# Altium schematic sheet Bank 13_Bank 15_Bank 16.SchDoc
size A3; SheetNumber: 11; SheetTotal: 22
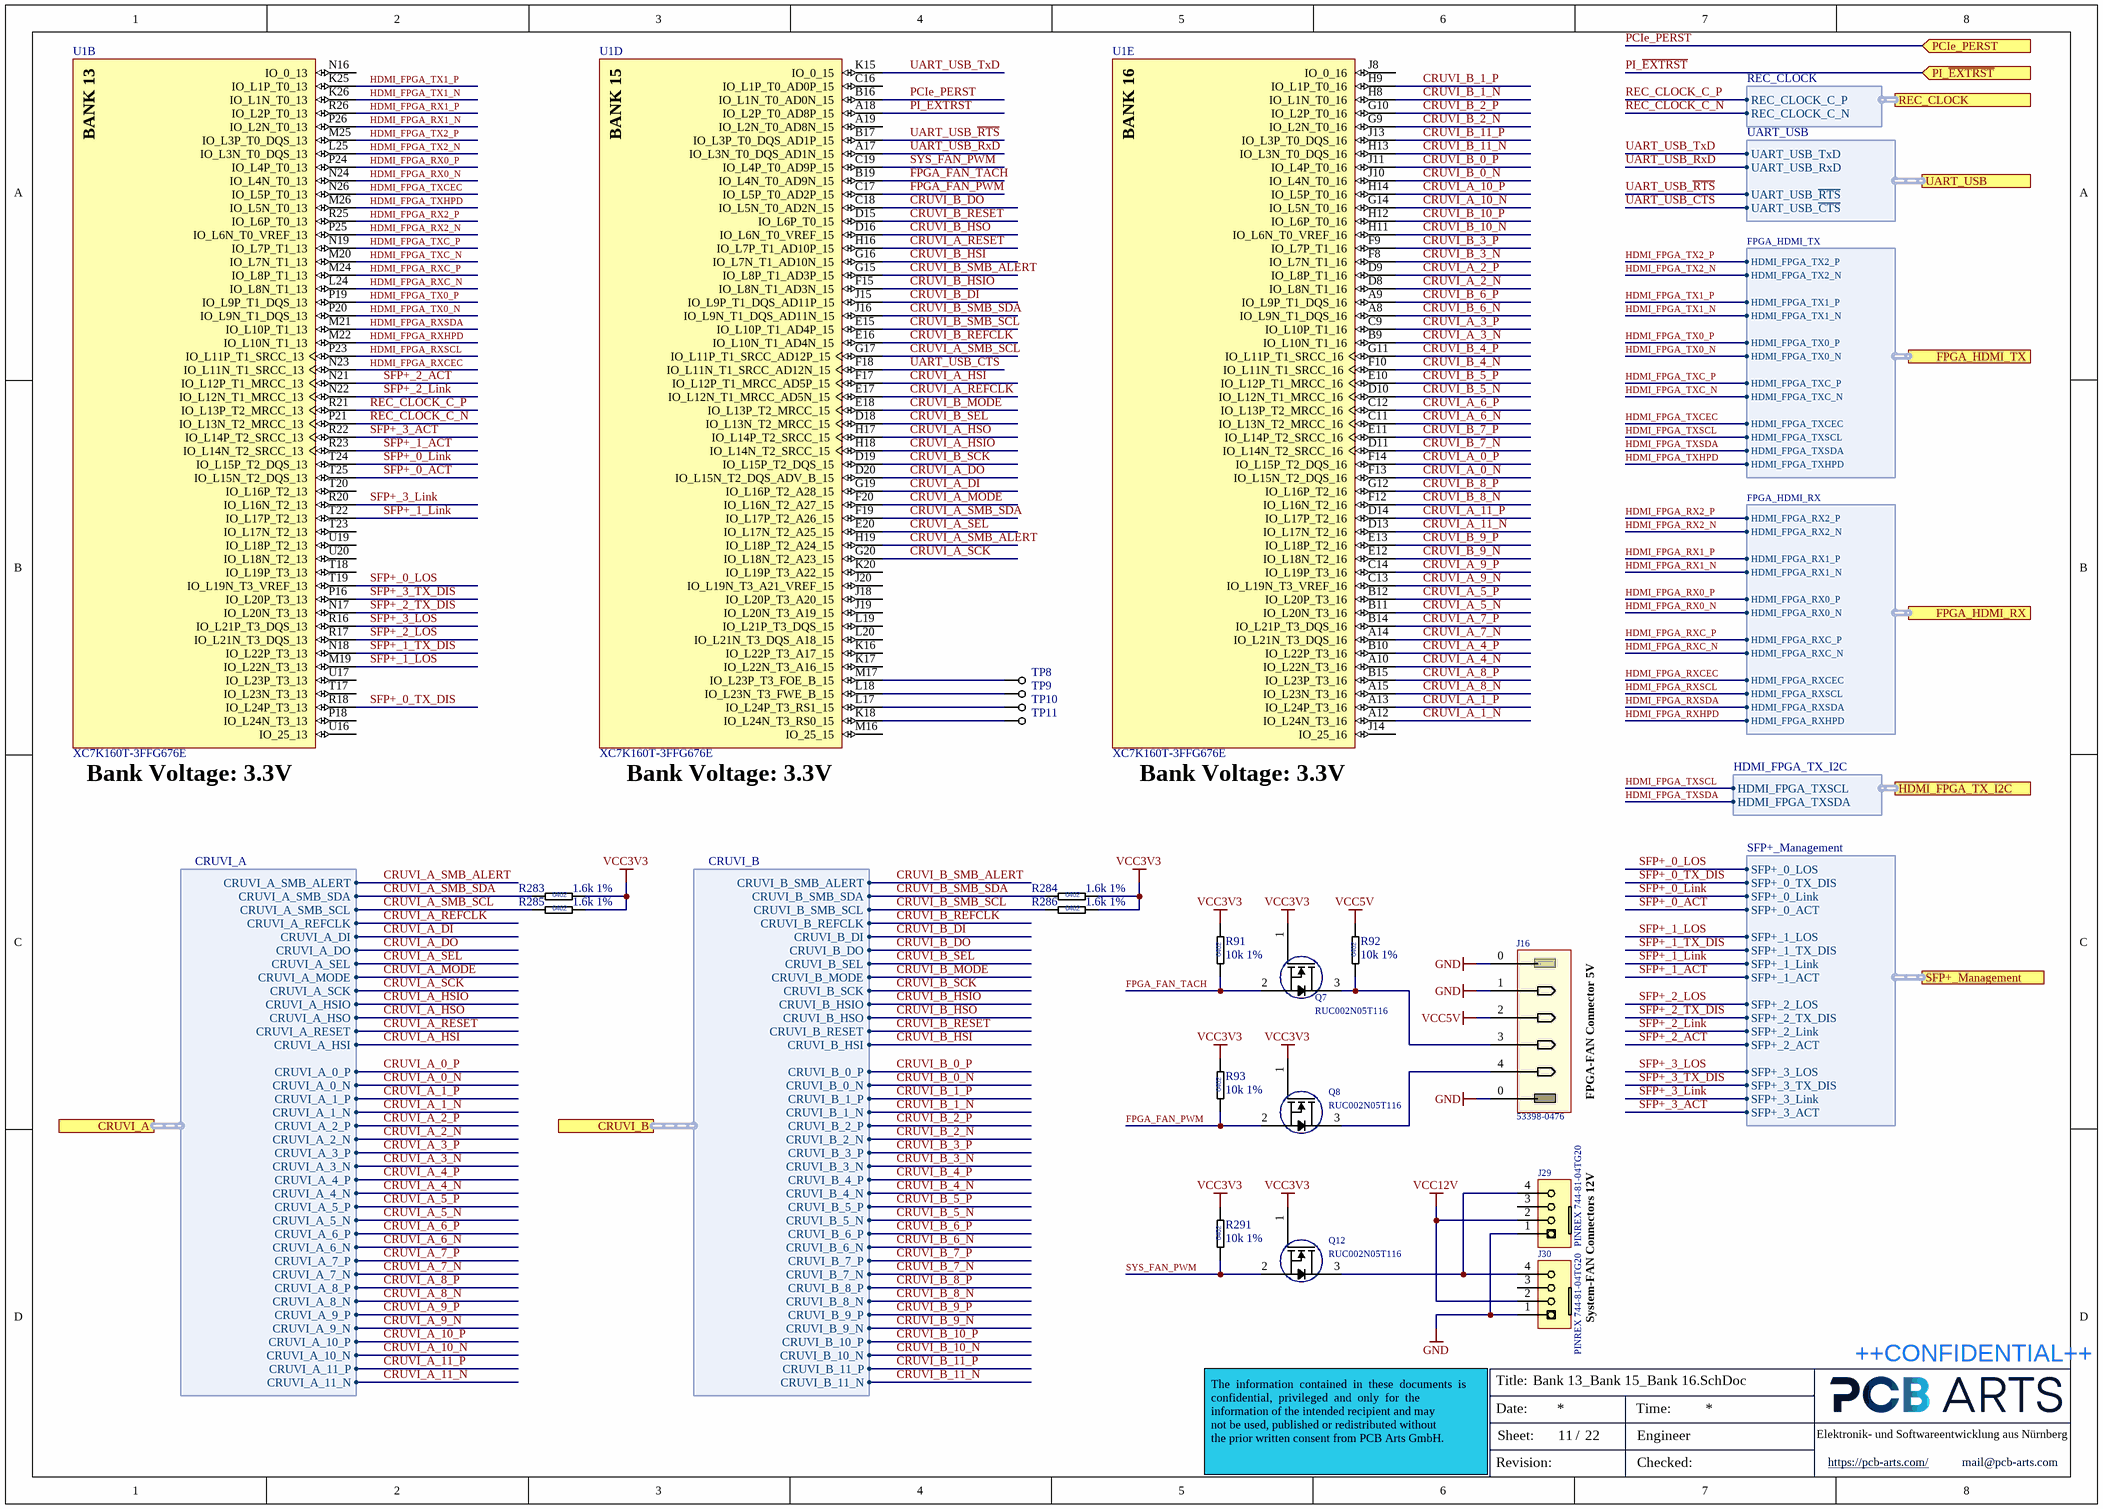
[diagram p0: Bank 13_Bank 15_Bank 16.SchDoc]

## Parts
J16  53398-0476  [Molex 53398-0476]
J29  PINREX 744-81-04TG20  [PINREX 744-81-04TG20]
J30  PINREX 744-81-04TG20  [PINREX 744-81-04TG20]
Q7  RUC002N05T116  [SOT95P251X112-3N]
Q8  RUC002N05T116  [SOT95P251X112-3N]
Q12  RUC002N05T116  [SOT95P251X112-3N]
R91  10k 1%  [RES_0402_L]
R92  10k 1%  [RES_0402_L]
R93  10k 1%  [RES_0402_L]
R283  1.6k 1%  [RES_0402_L]
R284  1.6k 1%  [RES_0402_L]
R285  1.6k 1%  [RES_0402_L]
R286  1.6k 1%  [RES_0402_L]
R291  10k 1%  [RES_0402_L]
TP8  Testpoint  [Testpoint 0.8mm]  (value not drawn)  (no BOM)
TP9  Testpoint  [Testpoint 0.8mm]  (value not drawn)  (no BOM)
TP10  Testpoint  [Testpoint 0.8mm]  (value not drawn)  (no BOM)
TP11  Testpoint  [Testpoint 0.8mm]  (value not drawn)  (no BOM)
U1  XC7K160T-3FFG676E  [BGA100P2700X2700X317-676N]  (parts B,D,E of 14)

## Ports
CRUVI_A (harness CRUVI_A, see Top-Level-Sheet[5B], Spare Pins[1B]), CRUVI_B (harness CRUVI_B, see Top-Level-Sheet[5B], Spare Pins[1C]), FPGA_HDMI_RX (harness FPGA_HDMI_RX, see Top-Level-Sheet[5B], FPGA_HDMI_IN_OUT[1D]), FPGA_HDMI_TX (harness FPGA_HDMI_TX, see Top-Level-Sheet[5B], FPGA_HDMI_IN_OUT[1A]), HDMI_FPGA_TX_I2C (harness HDMI_FPGA_TX_I2C, see Top-Level-Sheet[5B], I2C Multiplexer[7A]), PCIe_PERST (in, see Top-Level-Sheet[5B], Raspberry Pi CM4[8B]), PI_~{EXTRST} (in, see Top-Level-Sheet[5C], Raspberry Pi CM4[8B]), REC_CLOCK (harness REC_CLOCK, see Top-Level-Sheet[5B], System Clocks[1A]), SFP+_Management (harness SFP+_Management, see Top-Level-Sheet[5B], SFP+_Connectors[8C]), UART_USB (harness UART_USB, see Top-Level-Sheet[5B], USB-UART-interface[8A])

## Harnesses
UART_USB: UART_USB_TxD, UART_USB_RxD, UART_USB_~{RTS}, UART_USB_~{CTS}
FPGA_HDMI_TX: HDMI_FPGA_TX2_P, HDMI_FPGA_TX2_N, HDMI_FPGA_TX1_P, HDMI_FPGA_TX1_N, HDMI_FPGA_TX0_P, HDMI_FPGA_TX0_N, HDMI_FPGA_TXC_P, HDMI_FPGA_TXC_N, HDMI_FPGA_TXCEC, HDMI_FPGA_TXSCL, HDMI_FPGA_TXSDA, HDMI_FPGA_TXHPD
FPGA_HDMI_RX: HDMI_FPGA_RX2_P, HDMI_FPGA_RX2_N, HDMI_FPGA_RX1_P, HDMI_FPGA_RX1_N, HDMI_FPGA_RX0_P, HDMI_FPGA_RX0_N, HDMI_FPGA_RXC_P, HDMI_FPGA_RXC_N, HDMI_FPGA_RXCEC, HDMI_FPGA_RXSCL, HDMI_FPGA_RXSDA, HDMI_FPGA_RXHPD
HDMI_FPGA_TX_I2C: HDMI_FPGA_TXSCL, HDMI_FPGA_TXSDA
REC_CLOCK: REC_CLOCK_C_P, REC_CLOCK_C_N
SFP+_Management: SFP+_0_LOS, SFP+_0_TX_DIS, SFP+_0_Link, SFP+_0_ACT, SFP+_1_LOS, SFP+_1_TX_DIS, SFP+_1_Link, SFP+_1_ACT, SFP+_2_LOS, SFP+_2_TX_DIS, SFP+_2_Link, SFP+_2_ACT, SFP+_3_LOS, SFP+_3_TX_DIS, SFP+_3_Link, SFP+_3_ACT
CRUVI_A: CRUVI_A_SMB_ALERT, CRUVI_A_SMB_SDA, CRUVI_A_SMB_SCL, CRUVI_A_REFCLK, CRUVI_A_DI, CRUVI_A_DO, CRUVI_A_SEL, CRUVI_A_MODE, CRUVI_A_SCK, CRUVI_A_HSIO, CRUVI_A_HSO, CRUVI_A_RESET, CRUVI_A_HSI, CRUVI_A_0_P, CRUVI_A_0_N, CRUVI_A_1_P, CRUVI_A_1_N, CRUVI_A_2_P, CRUVI_A_2_N, CRUVI_A_3_P, CRUVI_A_3_N, CRUVI_A_4_P, CRUVI_A_4_N, CRUVI_A_5_P, CRUVI_A_5_N, CRUVI_A_6_P, CRUVI_A_6_N, CRUVI_A_7_P, CRUVI_A_7_N, CRUVI_A_8_P, CRUVI_A_8_N, CRUVI_A_9_P, CRUVI_A_9_N, CRUVI_A_10_P, CRUVI_A_10_N, CRUVI_A_11_P, CRUVI_A_11_N
CRUVI_B: CRUVI_B_SMB_ALERT, CRUVI_B_SMB_SDA, CRUVI_B_SMB_SCL, CRUVI_B_REFCLK, CRUVI_B_DI, CRUVI_B_DO, CRUVI_B_SEL, CRUVI_B_MODE, CRUVI_B_SCK, CRUVI_B_HSIO, CRUVI_B_HSO, CRUVI_B_RESET, CRUVI_B_HSI, CRUVI_B_0_P, CRUVI_B_0_N, CRUVI_B_1_P, CRUVI_B_1_N, CRUVI_B_2_P, CRUVI_B_2_N, CRUVI_B_3_P, CRUVI_B_3_N, CRUVI_B_4_P, CRUVI_B_4_N, CRUVI_B_5_P, CRUVI_B_5_N, CRUVI_B_6_P, CRUVI_B_6_N, CRUVI_B_7_P, CRUVI_B_7_N, CRUVI_B_8_P, CRUVI_B_8_N, CRUVI_B_9_P, CRUVI_B_9_N, CRUVI_B_10_P, CRUVI_B_10_N, CRUVI_B_11_P, CRUVI_B_11_N

## Nets
GND: J16.0 J16.1 J29.1 J30.1
VCC3V3: Q7.1(G) Q8.1(G) Q12.1(G) R91.2 R93.2 R283.2 R284.2 R285.2 R286.2 R291.2
VCC5V: J16.2 R92.2
VCC12V: J29.2 J30.2
CRUVI_A_0_N: U1.F13(IO_L15N_T2_DQS_16) ; port CRUVI_A.CRUVI_A_0_N
CRUVI_A_0_P: U1.F14(IO_L15P_T2_DQS_16) ; port CRUVI_A.CRUVI_A_0_P
CRUVI_A_1_N: U1.A12(IO_L24N_T3_16) ; port CRUVI_A.CRUVI_A_1_N
CRUVI_A_1_P: U1.A13(IO_L24P_T3_16) ; port CRUVI_A.CRUVI_A_1_P
CRUVI_A_2_N: U1.D8(IO_L8N_T1_16) ; port CRUVI_A.CRUVI_A_2_N
CRUVI_A_2_P: U1.D9(IO_L8P_T1_16) ; port CRUVI_A.CRUVI_A_2_P
CRUVI_A_3_N: U1.B9(IO_L10N_T1_16) ; port CRUVI_A.CRUVI_A_3_N
CRUVI_A_3_P: U1.C9(IO_L10P_T1_16) ; port CRUVI_A.CRUVI_A_3_P
CRUVI_A_4_N: U1.A10(IO_L22N_T3_16) ; port CRUVI_A.CRUVI_A_4_N
CRUVI_A_4_P: U1.B10(IO_L22P_T3_16) ; port CRUVI_A.CRUVI_A_4_P
CRUVI_A_5_N: U1.B11(IO_L20N_T3_16) ; port CRUVI_A.CRUVI_A_5_N
CRUVI_A_5_P: U1.B12(IO_L20P_T3_16) ; port CRUVI_A.CRUVI_A_5_P
CRUVI_A_6_N: U1.C11(IO_L13N_T2_MRCC_16) ; port CRUVI_A.CRUVI_A_6_N
CRUVI_A_6_P: U1.C12(IO_L13P_T2_MRCC_16) ; port CRUVI_A.CRUVI_A_6_P
CRUVI_A_7_N: U1.A14(IO_L21N_T3_DQS_16) ; port CRUVI_A.CRUVI_A_7_N
CRUVI_A_7_P: U1.B14(IO_L21P_T3_DQS_16) ; port CRUVI_A.CRUVI_A_7_P
CRUVI_A_8_N: U1.A15(IO_L23N_T3_16) ; port CRUVI_A.CRUVI_A_8_N
CRUVI_A_8_P: U1.B15(IO_L23P_T3_16) ; port CRUVI_A.CRUVI_A_8_P
CRUVI_A_9_N: U1.C13(IO_L19N_T3_VREF_16) ; port CRUVI_A.CRUVI_A_9_N
CRUVI_A_9_P: U1.C14(IO_L19P_T3_16) ; port CRUVI_A.CRUVI_A_9_P
CRUVI_A_10_N: U1.G14(IO_L5N_T0_16) ; port CRUVI_A.CRUVI_A_10_N
CRUVI_A_10_P: U1.H14(IO_L5P_T0_16) ; port CRUVI_A.CRUVI_A_10_P
CRUVI_A_11_N: U1.D13(IO_L17N_T2_16) ; port CRUVI_A.CRUVI_A_11_N
CRUVI_A_11_P: U1.D14(IO_L17P_T2_16) ; port CRUVI_A.CRUVI_A_11_P
CRUVI_A_DI: U1.G19(IO_L16P_T2_A28_15) ; port CRUVI_A.CRUVI_A_DI
CRUVI_A_DO: U1.D20(IO_L15N_T2_DQS_ADV_B_15) ; port CRUVI_A.CRUVI_A_DO
CRUVI_A_HSI: U1.F17(IO_L12P_T1_MRCC_AD5P_15) ; port CRUVI_A.CRUVI_A_HSI
CRUVI_A_HSIO: U1.H18(IO_L14N_T2_SRCC_15) ; port CRUVI_A.CRUVI_A_HSIO
CRUVI_A_HSO: U1.H17(IO_L14P_T2_SRCC_15) ; port CRUVI_A.CRUVI_A_HSO
CRUVI_A_MODE: U1.F20(IO_L16N_T2_A27_15) ; port CRUVI_A.CRUVI_A_MODE
CRUVI_A_REFCLK: U1.E17(IO_L12N_T1_MRCC_AD5N_15) ; port CRUVI_A.CRUVI_A_REFCLK
CRUVI_A_RESET: U1.H16(IO_L7P_T1_AD10P_15) ; port CRUVI_A.CRUVI_A_RESET
CRUVI_A_SCK: U1.G20(IO_L18N_T2_A23_15) ; port CRUVI_A.CRUVI_A_SCK
CRUVI_A_SEL: U1.E20(IO_L17N_T2_A25_15) ; port CRUVI_A.CRUVI_A_SEL
CRUVI_A_SMB_ALERT: U1.H19(IO_L18P_T2_A24_15) ; port CRUVI_A.CRUVI_A_SMB_ALERT
CRUVI_A_SMB_SCL: R285.1 U1.G17(IO_L11P_T1_SRCC_AD12P_15) ; port CRUVI_A.CRUVI_A_SMB_SCL
CRUVI_A_SMB_SDA: R283.1 U1.F19(IO_L17P_T2_A26_15) ; port CRUVI_A.CRUVI_A_SMB_SDA
CRUVI_B_0_N: U1.J10(IO_L4N_T0_16) ; port CRUVI_B.CRUVI_B_0_N
CRUVI_B_0_P: U1.J11(IO_L4P_T0_16) ; port CRUVI_B.CRUVI_B_0_P
CRUVI_B_1_N: U1.H8(IO_L1N_T0_16) ; port CRUVI_B.CRUVI_B_1_N
CRUVI_B_1_P: U1.H9(IO_L1P_T0_16) ; port CRUVI_B.CRUVI_B_1_P
CRUVI_B_2_N: U1.G9(IO_L2N_T0_16) ; port CRUVI_B.CRUVI_B_2_N
CRUVI_B_2_P: U1.G10(IO_L2P_T0_16) ; port CRUVI_B.CRUVI_B_2_P
CRUVI_B_3_N: U1.F8(IO_L7N_T1_16) ; port CRUVI_B.CRUVI_B_3_N
CRUVI_B_3_P: U1.F9(IO_L7P_T1_16) ; port CRUVI_B.CRUVI_B_3_P
CRUVI_B_4_N: U1.F10(IO_L11N_T1_SRCC_16) ; port CRUVI_B.CRUVI_B_4_N
CRUVI_B_4_P: U1.G11(IO_L11P_T1_SRCC_16) ; port CRUVI_B.CRUVI_B_4_P
CRUVI_B_5_N: U1.D10(IO_L12N_T1_MRCC_16) ; port CRUVI_B.CRUVI_B_5_N
CRUVI_B_5_P: U1.E10(IO_L12P_T1_MRCC_16) ; port CRUVI_B.CRUVI_B_5_P
CRUVI_B_6_N: U1.A8(IO_L9N_T1_DQS_16) ; port CRUVI_B.CRUVI_B_6_N
CRUVI_B_6_P: U1.A9(IO_L9P_T1_DQS_16) ; port CRUVI_B.CRUVI_B_6_P
CRUVI_B_7_N: U1.D11(IO_L14N_T2_SRCC_16) ; port CRUVI_B.CRUVI_B_7_N
CRUVI_B_7_P: U1.E11(IO_L14P_T2_SRCC_16) ; port CRUVI_B.CRUVI_B_7_P
CRUVI_B_8_N: U1.F12(IO_L16N_T2_16) ; port CRUVI_B.CRUVI_B_8_N
CRUVI_B_8_P: U1.G12(IO_L16P_T2_16) ; port CRUVI_B.CRUVI_B_8_P
CRUVI_B_9_N: U1.E12(IO_L18N_T2_16) ; port CRUVI_B.CRUVI_B_9_N
CRUVI_B_9_P: U1.E13(IO_L18P_T2_16) ; port CRUVI_B.CRUVI_B_9_P
CRUVI_B_10_N: U1.H11(IO_L6N_T0_VREF_16) ; port CRUVI_B.CRUVI_B_10_N
CRUVI_B_10_P: U1.H12(IO_L6P_T0_16) ; port CRUVI_B.CRUVI_B_10_P
CRUVI_B_11_N: U1.H13(IO_L3N_T0_DQS_16) ; port CRUVI_B.CRUVI_B_11_N
CRUVI_B_11_P: U1.J13(IO_L3P_T0_DQS_16) ; port CRUVI_B.CRUVI_B_11_P
CRUVI_B_DI: U1.J15(IO_L9P_T1_DQS_AD11P_15) ; port CRUVI_B.CRUVI_B_DI
CRUVI_B_DO: U1.C18(IO_L5N_T0_AD2N_15) ; port CRUVI_B.CRUVI_B_DO
CRUVI_B_HSI: U1.G16(IO_L7N_T1_AD10N_15) ; port CRUVI_B.CRUVI_B_HSI
CRUVI_B_HSIO: U1.F15(IO_L8N_T1_AD3N_15) ; port CRUVI_B.CRUVI_B_HSIO
CRUVI_B_HSO: U1.D16(IO_L6N_T0_VREF_15) ; port CRUVI_B.CRUVI_B_HSO
CRUVI_B_MODE: U1.E18(IO_L13P_T2_MRCC_15) ; port CRUVI_B.CRUVI_B_MODE
CRUVI_B_REFCLK: U1.E16(IO_L10N_T1_AD4N_15) ; port CRUVI_B.CRUVI_B_REFCLK
CRUVI_B_RESET: U1.D15(IO_L6P_T0_15) ; port CRUVI_B.CRUVI_B_RESET
CRUVI_B_SCK: U1.D19(IO_L15P_T2_DQS_15) ; port CRUVI_B.CRUVI_B_SCK
CRUVI_B_SEL: U1.D18(IO_L13N_T2_MRCC_15) ; port CRUVI_B.CRUVI_B_SEL
CRUVI_B_SMB_ALERT: U1.G15(IO_L8P_T1_AD3P_15) ; port CRUVI_B.CRUVI_B_SMB_ALERT
CRUVI_B_SMB_SCL: R286.1 U1.E15(IO_L10P_T1_AD4P_15) ; port CRUVI_B.CRUVI_B_SMB_SCL
CRUVI_B_SMB_SDA: R284.1 U1.J16(IO_L9N_T1_DQS_AD11N_15) ; port CRUVI_B.CRUVI_B_SMB_SDA
FPGA_FAN_PWM: Q8.2(D) R93.1 U1.C17(IO_L5P_T0_AD2P_15)
FPGA_FAN_TACH: Q7.2(D) R91.1 U1.B19(IO_L4N_T0_AD9N_15)
HDMI_FPGA_RX0_N: U1.N24(IO_L4N_T0_13) ; port FPGA_HDMI_RX.HDMI_FPGA_RX0_N
HDMI_FPGA_RX0_P: U1.P24(IO_L4P_T0_13) ; port FPGA_HDMI_RX.HDMI_FPGA_RX0_P
HDMI_FPGA_RX1_N: U1.P26(IO_L2N_T0_13) ; port FPGA_HDMI_RX.HDMI_FPGA_RX1_N
HDMI_FPGA_RX1_P: U1.R26(IO_L2P_T0_13) ; port FPGA_HDMI_RX.HDMI_FPGA_RX1_P
HDMI_FPGA_RX2_N: U1.P25(IO_L6N_T0_VREF_13) ; port FPGA_HDMI_RX.HDMI_FPGA_RX2_N
HDMI_FPGA_RX2_P: U1.R25(IO_L6P_T0_13) ; port FPGA_HDMI_RX.HDMI_FPGA_RX2_P
HDMI_FPGA_RXC_N: U1.L24(IO_L8N_T1_13) ; port FPGA_HDMI_RX.HDMI_FPGA_RXC_N
HDMI_FPGA_RXC_P: U1.M24(IO_L8P_T1_13) ; port FPGA_HDMI_RX.HDMI_FPGA_RXC_P
HDMI_FPGA_RXCEC: U1.N23(IO_L11N_T1_SRCC_13) ; port FPGA_HDMI_RX.HDMI_FPGA_RXCEC
HDMI_FPGA_RXHPD: U1.M22(IO_L10N_T1_13) ; port FPGA_HDMI_RX.HDMI_FPGA_RXHPD
HDMI_FPGA_RXSCL: U1.P23(IO_L11P_T1_SRCC_13) ; port FPGA_HDMI_RX.HDMI_FPGA_RXSCL
HDMI_FPGA_RXSDA: U1.M21(IO_L10P_T1_13) ; port FPGA_HDMI_RX.HDMI_FPGA_RXSDA
HDMI_FPGA_TX0_N: U1.P20(IO_L9N_T1_DQS_13) ; port FPGA_HDMI_TX.HDMI_FPGA_TX0_N
HDMI_FPGA_TX0_P: U1.P19(IO_L9P_T1_DQS_13) ; port FPGA_HDMI_TX.HDMI_FPGA_TX0_P
HDMI_FPGA_TX1_N: U1.K26(IO_L1N_T0_13) ; port FPGA_HDMI_TX.HDMI_FPGA_TX1_N
HDMI_FPGA_TX1_P: U1.K25(IO_L1P_T0_13) ; port FPGA_HDMI_TX.HDMI_FPGA_TX1_P
HDMI_FPGA_TX2_N: U1.L25(IO_L3N_T0_DQS_13) ; port FPGA_HDMI_TX.HDMI_FPGA_TX2_N
HDMI_FPGA_TX2_P: U1.M25(IO_L3P_T0_DQS_13) ; port FPGA_HDMI_TX.HDMI_FPGA_TX2_P
HDMI_FPGA_TXC_N: U1.M20(IO_L7N_T1_13) ; port FPGA_HDMI_TX.HDMI_FPGA_TXC_N
HDMI_FPGA_TXC_P: U1.N19(IO_L7P_T1_13) ; port FPGA_HDMI_TX.HDMI_FPGA_TXC_P
HDMI_FPGA_TXCEC: U1.N26(IO_L5P_T0_13) ; port FPGA_HDMI_TX.HDMI_FPGA_TXCEC
HDMI_FPGA_TXHPD: U1.M26(IO_L5N_T0_13) ; port FPGA_HDMI_TX.HDMI_FPGA_TXHPD
HDMI_FPGA_TXSCL: port FPGA_HDMI_TX.HDMI_FPGA_TXSCL, port HDMI_FPGA_TX_I2C.HDMI_FPGA_TXSCL
HDMI_FPGA_TXSDA: port FPGA_HDMI_TX.HDMI_FPGA_TXSDA, port HDMI_FPGA_TX_I2C.HDMI_FPGA_TXSDA
PCIe_PERST: U1.B16(IO_L1N_T0_AD0N_15) ; port PCIe_PERST
PI_~{EXTRST}: U1.A18(IO_L2P_T0_AD8P_15) ; port PI_~{EXTRST}
REC_CLOCK_C_N: U1.P21(IO_L13N_T2_MRCC_13) ; port REC_CLOCK.REC_CLOCK_C_N
REC_CLOCK_C_P: U1.R21(IO_L13P_T2_MRCC_13) ; port REC_CLOCK.REC_CLOCK_C_P
SFP+_0_ACT: U1.T25(IO_L15N_T2_DQS_13) ; port SFP+_Management.SFP+_0_ACT
SFP+_0_Link: U1.T24(IO_L15P_T2_DQS_13) ; port SFP+_Management.SFP+_0_Link
SFP+_0_LOS: U1.T19(IO_L19N_T3_VREF_13) ; port SFP+_Management.SFP+_0_LOS
SFP+_0_TX_DIS: U1.R18(IO_L24P_T3_13) ; port SFP+_Management.SFP+_0_TX_DIS
SFP+_1_ACT: U1.R23(IO_L14N_T2_SRCC_13) ; port SFP+_Management.SFP+_1_ACT
SFP+_1_Link: U1.T22(IO_L17P_T2_13) ; port SFP+_Management.SFP+_1_Link
SFP+_1_LOS: U1.M19(IO_L22N_T3_13) ; port SFP+_Management.SFP+_1_LOS
SFP+_1_TX_DIS: U1.N18(IO_L22P_T3_13) ; port SFP+_Management.SFP+_1_TX_DIS
SFP+_2_ACT: U1.N21(IO_L12P_T1_MRCC_13) ; port SFP+_Management.SFP+_2_ACT
SFP+_2_Link: U1.N22(IO_L12N_T1_MRCC_13) ; port SFP+_Management.SFP+_2_Link
SFP+_2_LOS: U1.R17(IO_L21N_T3_DQS_13) ; port SFP+_Management.SFP+_2_LOS
SFP+_2_TX_DIS: U1.N17(IO_L20N_T3_13) ; port SFP+_Management.SFP+_2_TX_DIS
SFP+_3_ACT: U1.R22(IO_L14P_T2_SRCC_13) ; port SFP+_Management.SFP+_3_ACT
SFP+_3_Link: U1.R20(IO_L16N_T2_13) ; port SFP+_Management.SFP+_3_Link
SFP+_3_LOS: U1.R16(IO_L21P_T3_DQS_13) ; port SFP+_Management.SFP+_3_LOS
SFP+_3_TX_DIS: U1.P16(IO_L20P_T3_13) ; port SFP+_Management.SFP+_3_TX_DIS
SYS_FAN_PWM: Q12.2(D) R291.1 U1.C19(IO_L4P_T0_AD9P_15)
UART_USB_~{CTS}: U1.F18(IO_L11N_T1_SRCC_AD12N_15) ; port UART_USB.UART_USB_~{CTS}
UART_USB_~{RTS}: U1.B17(IO_L3P_T0_DQS_AD1P_15) ; port UART_USB.UART_USB_~{RTS}
UART_USB_RxD: U1.A17(IO_L3N_T0_DQS_AD1N_15) ; port UART_USB.UART_USB_RxD
UART_USB_TxD: U1.K15(IO_0_15) ; port UART_USB.UART_USB_TxD
NetJ16_3: J16.3 Q7.3(S) R92.1
NetJ16_4: J16.4 Q8.3(S)
NetJ29_4: J29.4 J30.4 Q12.3(S)
NetTP8_1: TP8.1(GND) U1.M17(IO_L23P_T3_FOE_B_15)
NetTP9_1: TP9.1(GND) U1.L18(IO_L23N_T3_FWE_B_15)
NetTP10_1: TP10.1(GND) U1.L17(IO_L24P_T3_RS1_15)
NetTP11_1: TP11.1(GND) U1.K18(IO_L24N_T3_RS0_15)

Not connected (* = marked no-connect by the designer): J29 3; J30 3; U1 A19(IO_L2N_T0_AD8N_15) C16(IO_L1P_T0_AD0P_15) J8(IO_0_16) J14(IO_25_16) J18(IO_L20P_T3_A20_15) J19(IO_L20N_T3_A19_15) J20(IO_L19N_T3_A21_VREF_15) K16(IO_L22P_T3_A17_15) K17(IO_L22N_T3_A16_15) K20(IO_L19P_T3_A22_15) L19(IO_L21P_T3_DQS_15) L20(IO_L21N_T3_DQS_A18_15) M16(IO_25_15) N16(IO_0_13) P18(IO_L24N_T3_13) T17(IO_L23N_T3_13) T18(IO_L19P_T3_13) T20(IO_L16P_T2_13) T23(IO_L17N_T2_13) U16(IO_25_13) U17(IO_L23P_T3_13) U19(IO_L18P_T2_13) U20(IO_L18N_T2_13)

## Notes on the sheet
- (near U1) Bank Voltage: 3.3V
- FPGA-FAN Connector 5V
- System-FAN Connectors 12V
- Title:
- ++CONFIDENTIAL++
- Date:
- Sheet:
- /
- Time:
- Engineer
- Elektronik- und Softwareentwicklung aus Nürnberg
- The  information  contained  in  these  documents  is  confidential,  privileged  and  only  for  the
  information of the intended recipient and may
  not be used, published or redistributed without
  the prior written consent from PCB Arts GmbH.
- Revision:
- Checked:
- https://pcb-arts.com/
- mail@pcb-arts.com
- (in symbol RES_0402_1.6k_1%) 0402
- (in symbol RES_0402_10k_1%) 0402
- (in symbol XC7K160T-3FFG676E_Kintex-7 FPGA, 400 User I/Os, 8 GTX, FFG676, part B) BANK 13
- (in symbol XC7K160T-3FFG676E_Kintex-7 FPGA, 400 User I/Os, 8 GTX, FFG676, part D) BANK 15
- (in symbol XC7K160T-3FFG676E_Kintex-7 FPGA, 400 User I/Os, 8 GTX, FFG676, part E) BANK 16

## Library data of the parts
J16 = 53398-0476_1.25mm Pitch, PicoBlade PCB Header, Single Row, horizontal, SMD, 4 Pin: 1.25mm Pitch, PicoBlade PCB Header, Single Row, horizontal, SMD, 4 Pin; Manufacturer 1: Molex; Manufacturer 2 Prt. Nr.: 53398-0471; Manufacturer 1 Prt. Nr.: 53398-0476; Manufacturer 2: Molex
J29 J30 = FAN Connector header 2.54mm 4Pol Pinrex 744-81-04TG20: FAN Connector header 2.54mm 4Pol; Manufacturer 1: PINREX; Manufacturer 1 Prt. Nr.: 744-81-04TG20
Q7 Q8 Q12 = RUC002N05T116_MOSFET N-Ch 1.2 VGS Spec: MOSFET N-Ch 1.2 VGS Spec; Manufacturer 1: ROHM Semiconductor; Manufacturer 1 Prt. Nr.: RUC002N05T116
R91-R93 R291 = RES_0402_10k_1%: Thick Film Resistors - SMD 10kOhm 1%; Manufacturer 1: Vishay / Dale; Manufacturer 1 Prt. Nr.: CRCW040210K0FKEDC; Manufacturer 2 Prt. Nr.: RC0402FR-7W10KL; Manufacturer 2: Yageo
R283-R286 = RES_0402_1.6k_1%: Thick Film Resistors - SMD 1.6kOhm 1%; Manufacturer 1: Vishay / Dale; Manufacturer 1 Prt. Nr.: CRCW04021K60FKEDC; Manufacturer 2 Prt. Nr.: RC0402FR-7W1K6L; Manufacturer 2: Yageo
TP8-TP11 = Testpoint 0.8mm
U1 = XC7K160T-3FFG676E_Kintex-7 FPGA, 400 User I/Os, 8 GTX, FFG676: Kintex-7 FPGA, 400 User I/Os, 8 GTX, 676-Ball BGA, Speed Grade 3, Extended Grade, Pb-Free; Manufacturer 1: Xilinx; Manufacturer 1 Prt. Nr.: XC7K160T-3FFG676E; ComponentLink1URL: http://www.xilinx.com/support/documentation/data_sheets/ds180_7Series_Overview.pdf; ComponentLink2URL: http://www.xilinx.com/support/documentation/user_guides/ug865-Zynq-7000-Pkg-Pinout.pdf; ComponentLink1Description: Datasheet; ComponentLink2Description: Package Specification